# EAGLE design Analog Controller PCB (EAGLE 9.6.2)
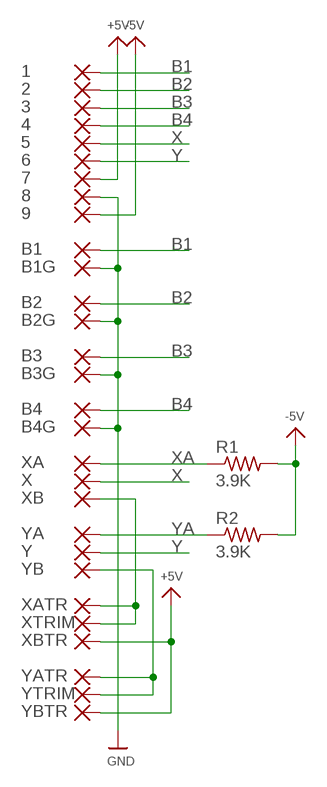
[diagram p0: schematic, sheet 1]

## Parts
1  SMD2  [SMD1,27-2,54]
2  SMD2  [SMD1,27-2,54]
3  SMD2  [SMD1,27-2,54]
4  SMD2  [SMD1,27-2,54]
5  SMD2  [SMD1,27-2,54]
6  SMD2  [SMD1,27-2,54]
7  SMD2  [SMD1,27-2,54]
8  SMD2  [SMD1,27-2,54]
9  SMD2  [SMD1,27-2,54]
B1  SMD2  [SMD1,27-2,54]
B1G  SMD2  [SMD1,27-2,54]
B2  SMD2  [SMD1,27-2,54]
B2G  SMD2  [SMD1,27-2,54]
B3  SMD2  [SMD1,27-2,54]
B3G  SMD2  [SMD1,27-2,54]
B4  SMD2  [SMD1,27-2,54]
B4G  SMD2  [SMD1,27-2,54]
R1  3.9K  R-US_R1206  [R1206]
R2  3.9K  R-US_R1206  [R1206]
X  SMD2  [SMD1,27-2,54]
XA  SMD2  [SMD1,27-2,54]
XATR  SMD2  [SMD1,27-2,54]
XB  SMD2  [SMD1,27-2,54]
XBTR  SMD2  [SMD1,27-2,54]
XTRIM  SMD2  [SMD1,27-2,54]
Y  SMD2  [SMD1,27-2,54]
YA  SMD2  [SMD1,27-2,54]
YATR  SMD2  [SMD1,27-2,54]
YB  SMD2  [SMD1,27-2,54]
YBTR  SMD2  [SMD1,27-2,54]
YTRIM  SMD2  [SMD1,27-2,54]

## Nets
+5V: 7.1(P) XBTR.1(P) YBTR.1(P)
-5V: 9.1(P) R1.2 R2.2
B1: 1.1(P) B1.1(P)
B2: 2.1(P) B2.1(P)
B3: 3.1(P) B3.1(P)
B4: 4.1(P) B4.1(P)
GND: 8.1(P) B1G.1(P) B2G.1(P) B3G.1(P) B4G.1(P)
X: 5.1(P) X.1(P)
XA: R1.1 XA.1(P)
XB: XATR.1(P) XB.1(P) XTRIM.1(P)
Y: 6.1(P) Y.1(P)
YA: R2.1 YA.1(P)
YB: YATR.1(P) YB.1(P) YTRIM.1(P)

## Library data of the parts
1-9 B1 B1G B2 B2G B3 B3G B4 B4G X XA XATR XB XBTR XTRIM Y YA YATR YB YBTR YTRIM = wirepad:SMD2: SMD PAD
R1 R2 = adafruit:R-US_: RESISTOR, American symbol

## Board
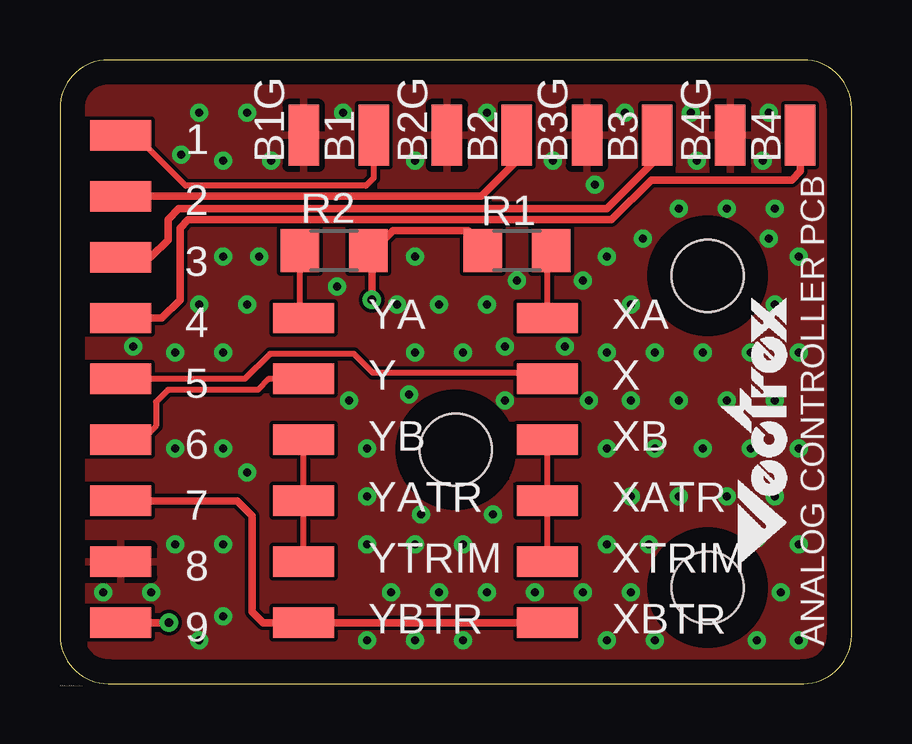
[diagram p1: board, top side]
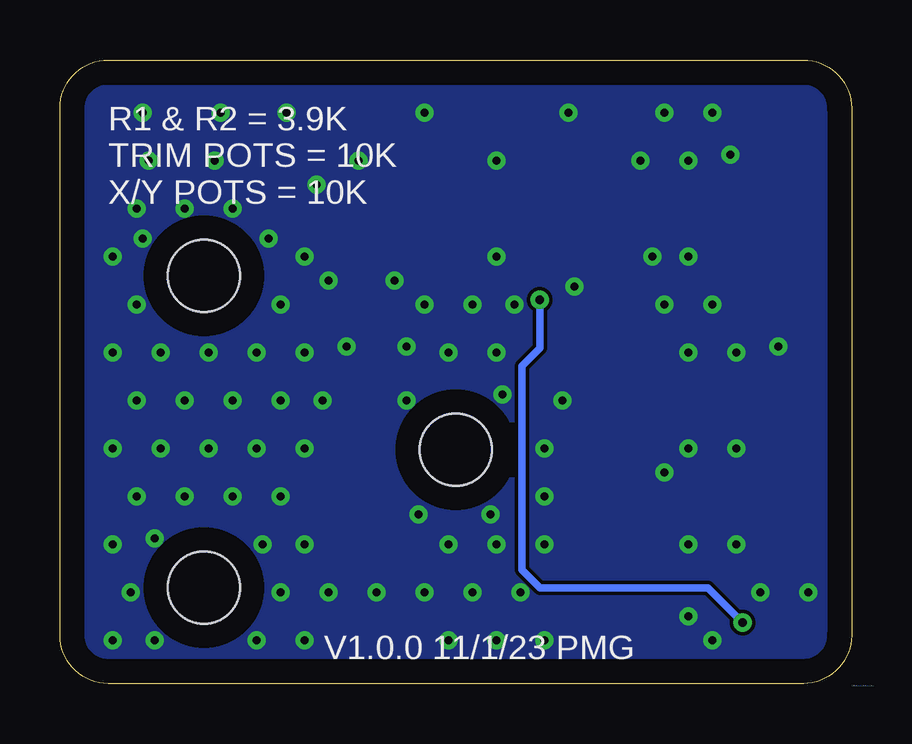
[diagram p2: board, bottom side, seen from below]

Size 33 x 26 mm. Coordinates in mm from the lower left corner, seen from the top.
Outline: 0,24 0,2 arc90 2,0 31,0 arc90 33,2 33,24 arc90 31,26 2,26 arc90 0,24
Copper layers (1*16): Top 0.035mm / dielectric 1.5mm / Bottom 0.035mm
Design rules "default": minimum track width 6mil, minimum drill 0.35mm, track to track 6mil, track to pad 6mil, pad to pad 6mil, via to via 6mil, smd to smd 6mil, copper to edge 40mil, drill to drill 6mil, minimum pad ring 10mil, minimum via ring 8mil, stop-mask expansion 4mil, vias tented up to drill 0.5mm, thermal gap 10mil
Holes 3 mm at 27,4 27,17 16.5,9.75

### Footprints (pad centres in the part's own frame; a part is rotated, then mirrored left to right if it is on the bottom)
SMD1,27-2,54 = smd 1.27 x 2.54: 1 0,0
R1206 = smd 1.6 x 1.803: 1 -1.422,0; 2 1.422,0

### Placement (x,y rotation side)
1  2.54,22.86 90 top
2  2.54,20.32 90 top
3  2.54,17.78 90 top
4  2.54,15.24 90 top
5  2.54,12.7 90 top
6  2.54,10.16 90 top
7  2.54,7.62 90 top
8  2.54,5.08 90 top
9  2.54,2.54 90 top
B1  13.08,22.86 0 top
B1G  10.16,22.86 0 top
B2  19.05,22.86 0 top
B2G  16.13,22.86 0 top
B3  24.89,22.86 0 top
B3G  21.97,22.86 0 top
B4  30.86,22.86 0 top
B4G  27.94,22.86 0 top
R1  19.05,18.05 180 top
R2  11.43,18.05 0 top
X  20.32,12.7 270 top
XA  20.32,15.24 270 top
XATR  20.32,7.62 270 top
XB  20.32,10.16 270 top
XBTR  20.32,2.54 270 top
XTRIM  20.32,5.08 270 top
Y  10.16,12.7 270 top
YA  10.16,15.24 270 top
YATR  10.16,7.62 270 top
YB  10.16,10.16 270 top
YBTR  10.16,2.54 270 top
YTRIM  10.16,5.08 270 top

### Tracks (layer width: path | path; a pad name or v marks a point on that pad's centre or on a via)
+5V
  Top 0.305: XBTR.1 YBTR.1 8.46,2.54 8,3 8,7 7.38,7.62 7.1
-5V  (via drill 0.35)
  Top 0.305: 9.1 v4.54,2.54 | v13,16 13,18.05 R2.2 13.05,18.05 13.88,18.88 17,18.88 17.63,18.25 R1.2
  Bottom 0.305: v4.54,2.54 6,4 13,4 13.75,4.75 13.75,13.25 13,14 v13,16
B1
  Top 0.254: B1.1 13.08,21.08 12.75,20.75 5.25,20.75 3.14,22.86 1.1
B2
  Top 0.305: B2.1 19.05,21.8 17.57,20.32 2.1
B3
  Top 0.305: 3.1 3.78,17.78 4.5,18.5 4.5,19.35 4.94,19.79 22.79,19.79 24.89,21.89 B3.1
B4
  Top 0.305: B4.1 30.86,21.36 30.5,21 24.65,21 22.98,19.34 5.34,19.34 5,19 5,16 4.24,15.24 4.1
GND  (via drill 0.35)
  other vias: 1.8,3.8 3.05,14.05 5.8,1.8 3.8,3.8 4.8,5.8 4.8,9.8 4.8,13.8 5.05,22.05 6.8,2.8 6.8,5.8 6.8,9.8 6.8,13.8 5.8,15.8 6.8,17.8 6.8,21.8 5.8,23.8 7.8,8.8 7.8,15.8 8.3,17.8 8.8,21.8 7.8,23.8 12.8,1.8 12.8,5.8 12.8,7.8 12.8,9.8 12.05,11.8 11.55,16.55 11.8,23.8 14.8,1.8 13.8,3.8 14.8,5.8 14.8,13.8 14.05,15.8 14.8,17.8 14.8,21.8 16.8,1.8 15.8,3.8 16.8,5.8 15.05,7.05 14.55,12.05 16.8,13.8 15.8,15.8 17.8,3.8 18.05,7.05 18.55,11.8 18.55,14.05 17.8,15.8 19.05,16.8 17.8,23.8 19.8,3.8 21.05,14.05 20.55,21.8 22.8,1.8 21.8,3.8 22.8,5.8 22.8,9.8 22.05,11.8 22.8,13.8 21.8,16.8 22.8,17.8 22.3,20.8 24.8,1.8 23.8,3.8 24.55,5.8 23.8,7.8 24.8,9.8 23.8,11.8 24.8,13.8 23.8,15.8 24.3,18.55 23.55,23.8 25.8,7.8 26.8,9.8 25.8,11.8 26.8,13.8 25.8,19.8 26.55,21.8 26.3,23.8 29.05,1.8 29.05,6.05 27.8,7.8 28.8,9.8 27.8,11.8 28.8,13.8 29.55,18.55 27.8,19.8 29.3,21.8 30.8,1.8 30.05,3.8 30.8,5.8 29.8,7.8 30.8,9.8 29.8,11.8 30.8,13.8 29.8,15.8 30.8,17.8 29.8,19.8 29.55,23.8
  pour Top: 31,0 2,0 arc-90 0,2 0,24 arc-90 2,26 31,26 arc-90 33,24 33,2 arc-90
  pour Bottom: 31,0 2,0 arc-90 0,2 0,24 arc-90 2,26 31,26 arc-90 33,24 33,2 arc-90
X
  Top 0.254: X.1 20.07,12.95 13.05,12.95 12.25,13.75 8.75,13.75 7.7,12.7 5.1
XA
  Top 0.254: XA.1 20.32,17.9 R1.1
XB
  Top 0.254: XTRIM.1 XATR.1 XB.1
Y
  Top 0.254: Y.1 8.7,12.7 8.25,12.25 4.5,12.25 4,11.75 4,10.75 3.41,10.16 6.1
YA
  Top 0.254: YA.1 10.01,15.39 R2.1
YB
  Top 0.254: YTRIM.1 YATR.1 YB.1

### Text on the board
tNames: ANALOG CONTROLLER PCB | D:/Downloads/download.bmp
bNames: R1 & R2 = 3.9K / TRIM POTS = 10K / X/Y POTS = 10K | V1.0.0 11/1/23 PMG | D:/Downloads/download.bmp